# Altium schematic sheet OMODRI_EnDATEnc.SchDoc
size A3; Date: Not shown in title block; ApprovedBy: Not shown in title block; CheckedBy: Not shown in title block; Author: Not shown in title block; CompanyName: Not shown in title block; Engineer: Not shown in title block; Organization: Not shown in title block; Address1: Not shown in title block; Address2: Not shown in title block; Address3: Not shown in title block; Address4: Not shown in title block; DocumentNumber: 1; Revision: Use project parameter SCH_Rev; SheetNumber: 3; SheetTotal: 4; PageSetup: Record=PageOptions|CenterHorizontal=True|CenterVertical=True|PrintScale=1.00|XCorrection=1.00|YCorrection=1.00|PrintKind=0|BorderSize=5000000|LeftOffset=0|BottomOffset=0|Orientation=2|PaperLength=1000|PaperWidth=1000|Scale=100|PaperSource=15|PrintQuality=600|MediaType=1|DitherType=10|PaperKind=Letter|PrintScaleMode=1; CurrentTime: Not shown in title block; CurrentDate: Not shown in title block; Time: Not shown in title block; DocumentFullPathAndName: Not shown in title block; DocumentName: Not shown in title block; ModifiedDate: Not shown in title block; ImagePath: Not shown in title block
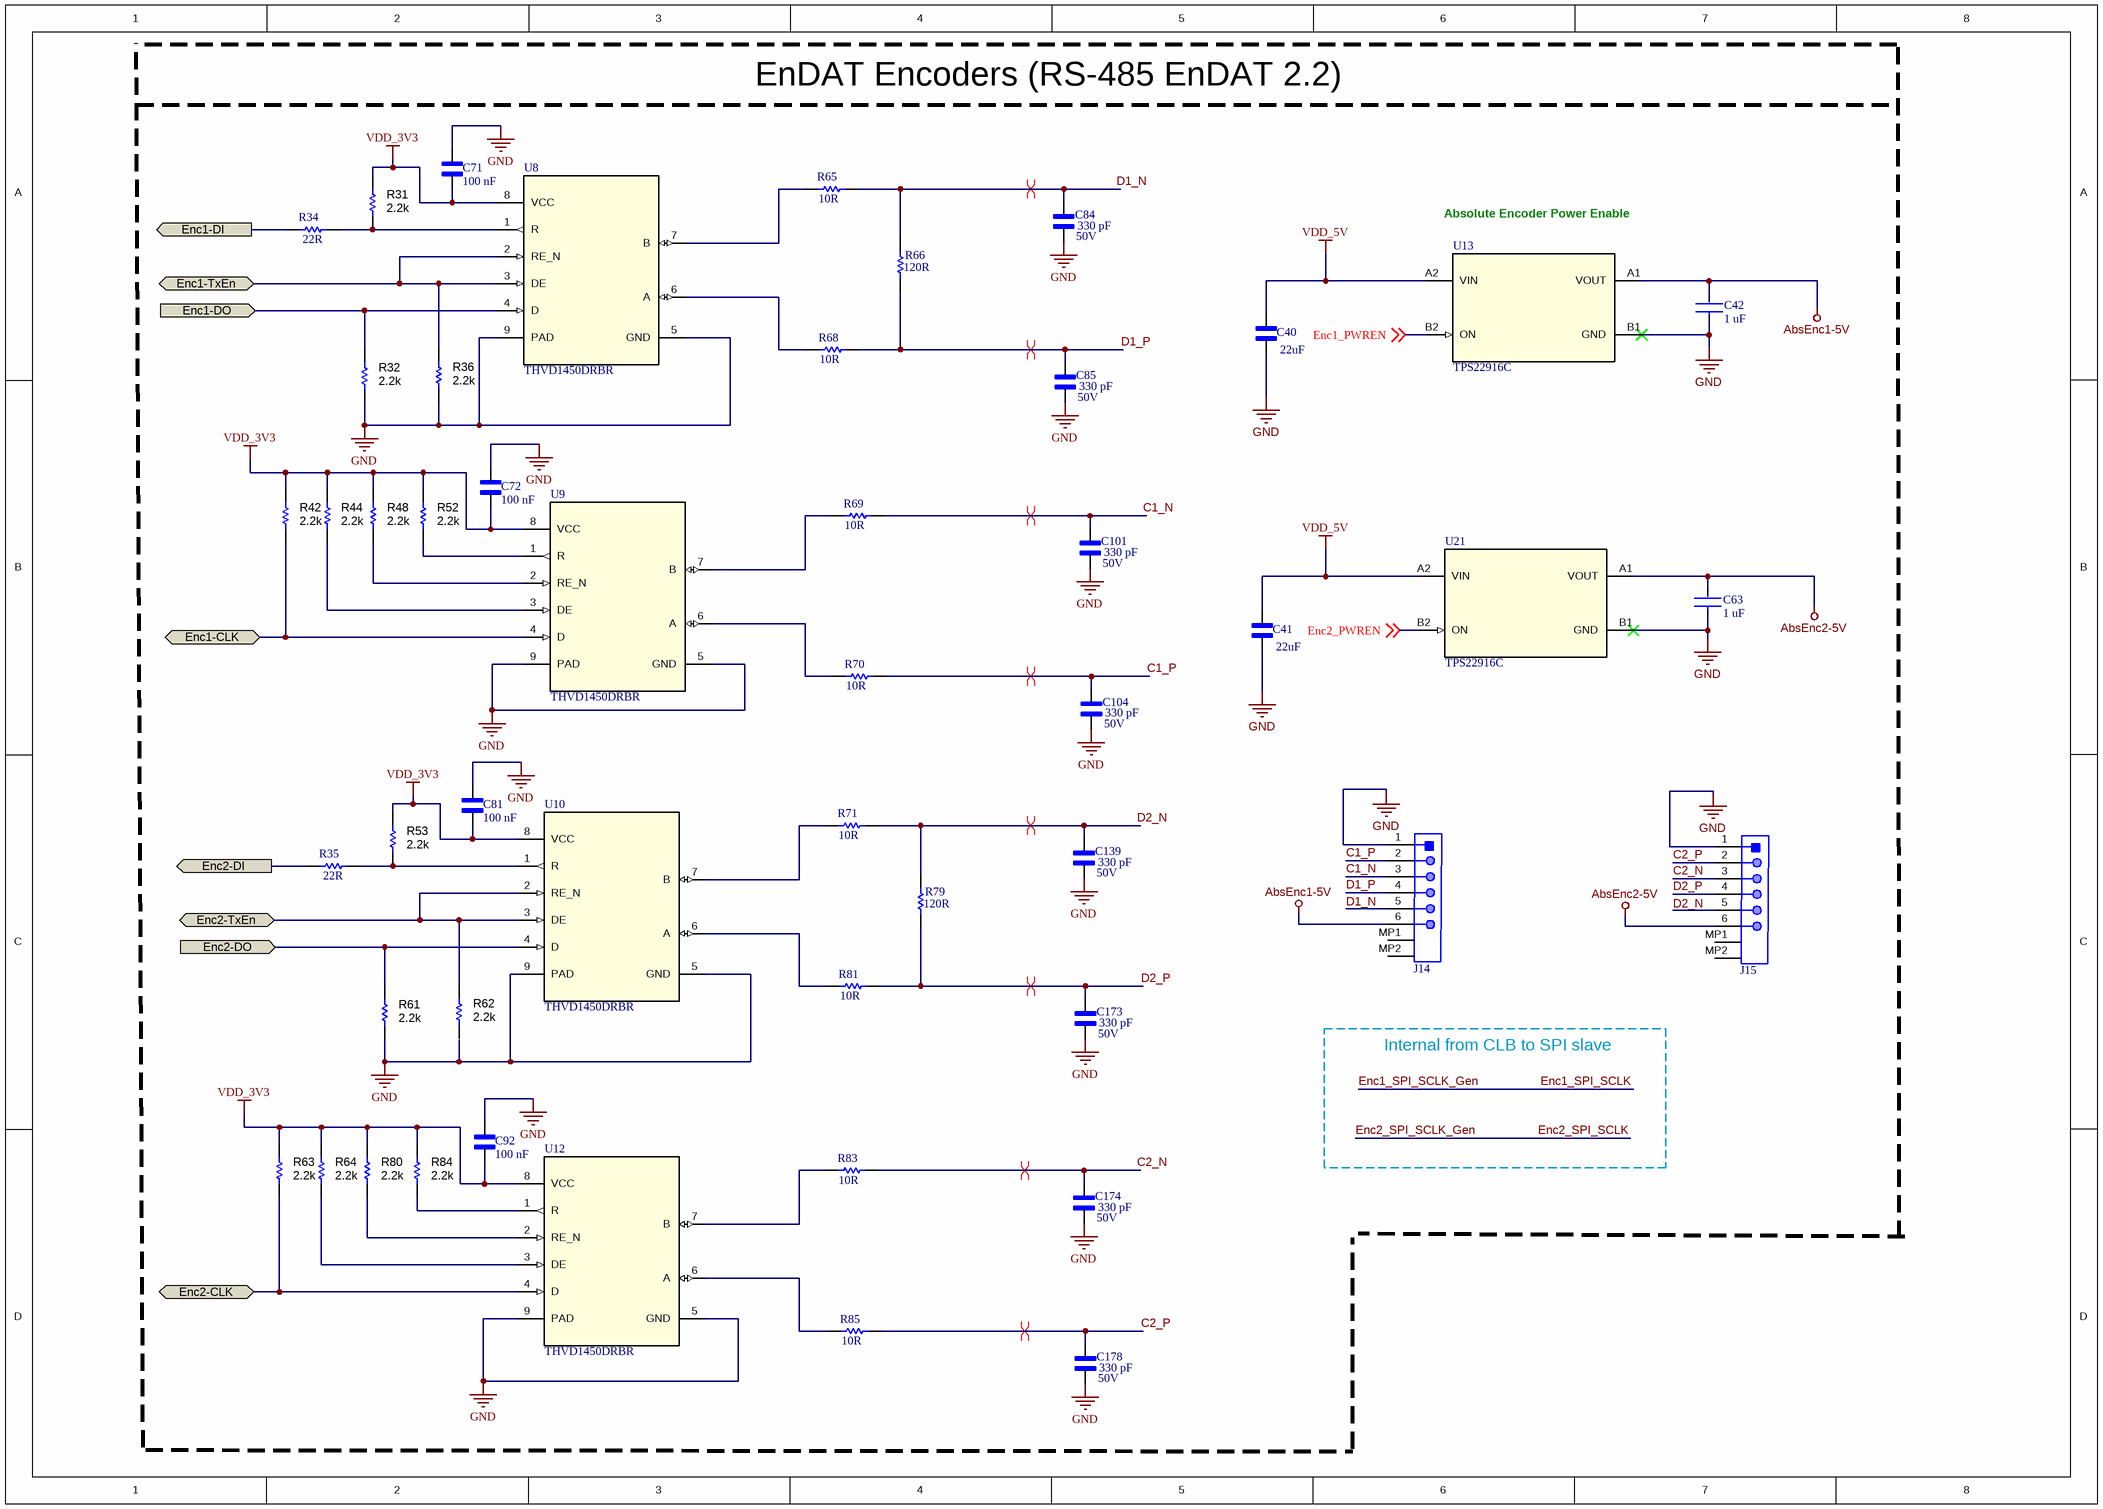
[diagram p0: OMODRI_EnDATEnc.SchDoc]

## Parts
C40  value 22uF  [CAPC1005X55N]  (hidden comment: CL05A226MQ5N6J8)
C41  value 22uF  [CAPC1005X55N]  (hidden comment: CL05A226MQ5N6J8)
C42  value 1 uF  [FP-CC0201-BA-MFG]  (hidden comment: CC0201MRX5R5BB105)
C63  value 1 uF  [FP-CC0201-BA-MFG]  (hidden comment: CC0201MRX5R5BB105)
C71  value 100 nF  [CAPC0603X33N]  (hidden comment: GRM033R61E104KE14D)
C72  value 100 nF  [CAPC0603X33N]  (hidden comment: GRM033R61E104KE14D)
C81  value 100 nF  [CAPC0603X33N]  (hidden comment: GRM033R61E104KE14D)
C84  value 330 pF  Voltage: 50V  [CAPC0603X33N]  (hidden comment: GRM033R71H331KA12D)
C85  value 330 pF  Voltage: 50V  [CAPC0603X33N]  (hidden comment: GRM033R71H331KA12D)
C92  value 100 nF  [CAPC0603X33N]  (hidden comment: GRM033R61E104KE14D)
C101  value 330 pF  Voltage: 50V  [CAPC0603X33N]  (hidden comment: GRM033R71H331KA12D)
C104  value 330 pF  Voltage: 50V  [CAPC0603X33N]  (hidden comment: GRM033R71H331KA12D)
C139  value 330 pF  Voltage: 50V  [CAPC0603X33N]  (hidden comment: GRM033R71H331KA12D)
C173  value 330 pF  Voltage: 50V  [CAPC0603X33N]  (hidden comment: GRM033R71H331KA12D)
C174  value 330 pF  Voltage: 50V  [CAPC0603X33N]  (hidden comment: GRM033R71H331KA12D)
C178  value 330 pF  Voltage: 50V  [CAPC0603X33N]  (hidden comment: GRM033R71H331KA12D)
J14  Conn_JST_BM06B-GHS-TBT_LF_SN_N_eec  [JST_BM06B-GHS-TBT_LF_SN_N_0]  (value not drawn)
J15  Conn_JST_BM06B-GHS-TBT_LF_SN_N_eec  [JST_BM06B-GHS-TBT_LF_SN_N_0]  (value not drawn)
R31  ValueDisplayed: 2.2k  [0402]  (hidden comment: CRCW04022K20JNED)
R32  ValueDisplayed: 2.2k  [0402]  (hidden comment: CRCW04022K20JNED)
R34  value 22R  [RESC1005X40X25ML05T05]  (hidden comment: ERJ-2GEJ220X)
R35  value 22R  [RESC1005X40X25ML05T05]  (hidden comment: ERJ-2GEJ220X)
R36  ValueDisplayed: 2.2k  [0402]  (hidden comment: CRCW04022K20JNED)
R42  ValueDisplayed: 2.2k  [0402]  (hidden comment: CRCW04022K20JNED)
R44  ValueDisplayed: 2.2k  [0402]  (hidden comment: CRCW04022K20JNED)
R48  ValueDisplayed: 2.2k  [0402]  (hidden comment: CRCW04022K20JNED)
R52  ValueDisplayed: 2.2k  [0402]  (hidden comment: CRCW04022K20JNED)
R53  ValueDisplayed: 2.2k  [0402]  (hidden comment: CRCW04022K20JNED)
R61  ValueDisplayed: 2.2k  [0402]  (hidden comment: CRCW04022K20JNED)
R62  ValueDisplayed: 2.2k  [0402]  (hidden comment: CRCW04022K20JNED)
R63  ValueDisplayed: 2.2k  [0402]  (hidden comment: CRCW04022K20JNED)
R64  ValueDisplayed: 2.2k  [0402]  (hidden comment: CRCW04022K20JNED)
R65  Resistance: 10R  [RESC1005X40X25ML05T10]  (hidden comment: CRCW040210R0FKEDHP)
R66  Resistance: 120R  [RESC1005X40X25ML05T10]  (hidden comment: CRCW0402120RJNEDHP)
R68  Resistance: 10R  [RESC1005X40X25ML05T10]  (hidden comment: CRCW040210R0FKEDHP)
R69  Resistance: 10R  [RESC1005X40X25ML05T10]  (hidden comment: CRCW040210R0FKEDHP)
R70  Resistance: 10R  [RESC1005X40X25ML05T10]  (hidden comment: CRCW040210R0FKEDHP)
R71  Resistance: 10R  [RESC1005X40X25ML05T10]  (hidden comment: CRCW040210R0FKEDHP)
R79  Resistance: 120R  [RESC1005X40X25ML05T10]  (hidden comment: CRCW0402120RJNEDHP)
R80  ValueDisplayed: 2.2k  [0402]  (hidden comment: CRCW04022K20JNED)
R81  Resistance: 10R  [RESC1005X40X25ML05T10]  (hidden comment: CRCW040210R0FKEDHP)
R83  Resistance: 10R  [RESC1005X40X25ML05T10]  (hidden comment: CRCW040210R0FKEDHP)
R84  ValueDisplayed: 2.2k  [0402]  (hidden comment: CRCW04022K20JNED)
R85  Resistance: 10R  [RESC1005X40X25ML05T10]  (hidden comment: CRCW040210R0FKEDHP)
U8  THVD1450DRBR  [DRB0008F]
U9  THVD1450DRBR  [DRB0008F]
U10  THVD1450DRBR  [DRB0008F]
U12  THVD1450DRBR  [DRB0008F]
U13  TPS22916C  [YFP0004ABAB]
U21  TPS22916C  [YFP0004ABAB]

## Ports
Enc1-CLK (bidir), Enc1-DI (out), Enc1-DO (in), Enc1-TxEn (bidir), Enc2-CLK (bidir), Enc2-DI (out), Enc2-DO (in), Enc2-TxEn (bidir)

## Nets
AbsEnc1-5V: C42.2 J14.6 U13.A1(VOUT)
AbsEnc2-5V: C63.2 J15.6 U21.A1(VOUT)
GND: C40.1 C41.1 C42.1 C63.1 C71.2 C72.2 C81.2 C84.1 C85.1 C92.2 C101.1 C104.1 C139.1 C173.1 C174.1 C178.1 J14.1 J15.1 R32.1 R61.1 U8.5(GND) U8.9(PAD) U9.5(GND) U9.9(PAD) U10.5(GND) U10.9(PAD) U12.5(GND) U12.9(PAD) U13.B1(GND) U21.B1(GND)
VDD_3V3: C71.1 C72.1 C81.1 C92.1 R31.2 R42.2 R44.2 R48.2 R52.2 R53.2 R63.2 R64.2 R80.2 R84.2 U8.8(VCC) U9.8(VCC) U10.8(VCC) U12.8(VCC)
VDD_5V: C40.2 C41.2 U13.A2(VIN) U21.A2(VIN)
C1_N: C101.2 J14.3 R69.2
C1_P: C104.2 J14.2 R70.2
C2_N: C174.2 J15.3 R83.2
C2_P: C178.2 J15.2 R85.2
D1_N: C84.2 R65.2 R66.2
D1_P: C85.2 J14.4 R66.1 R68.2
D2_N: C139.2 R71.2 R79.2
D2_P: C173.2 J15.4 R79.1 R81.2
Enc1-CLK: R42.1 U9.4(D) ; port Enc1-CLK
Enc1-DI: R34.1 ; port Enc1-DI
Enc1-DO: R32.2 U8.4(D) ; port Enc1-DO
Enc1-TxEn: R36.2 U8.2(RE_N) U8.3(DE) ; port Enc1-TxEn
Enc1_PWREN: U13.B2(ON) ; off-sheet Enc1_PWREN
Enc2-CLK: R63.1 U12.4(D) ; port Enc2-CLK
Enc2-DI: R35.1 ; port Enc2-DI
Enc2-DO: R61.2 U10.4(D) ; port Enc2-DO
Enc2-TxEn: R62.2 U10.2(RE_N) U10.3(DE) ; port Enc2-TxEn
Enc2_PWREN: U21.B2(ON) ; off-sheet Enc2_PWREN
NetR31_1: R31.1 R34.2 U8.1(R)
NetR35_2: R35.2 R53.1 U10.1(R)
NetR44_1: R44.1 U9.3(DE)
NetR48_1: R48.1 U9.2(RE_N)
NetR52_1: R52.1 U9.1(R)
NetR64_1: R64.1 U12.3(DE)
NetR65_1: R65.1 U8.7(B)
NetR68_1: R68.1 U8.6(A)
NetR69_1: R69.1 U9.7(B)
NetR70_1: R70.1 U9.6(A)
NetR71_1: R71.1 U10.7(B)
NetR80_1: R80.1 U12.2(RE_N)
NetR81_1: R81.1 U10.6(A)
NetR83_1: R83.1 U12.7(B)
NetR84_1: R84.1 U12.1(R)
NetR85_1: R85.1 U12.6(A)

Not connected (* = marked no-connect by the designer): J14 5 MP1 MP2; J15 5 MP1 MP2; R36 1; R62 1

## Layout directives
differential pair: C1_N, C1_P, C2_N, C2_P, D1_N, D1_P, D2_N, D2_P

## Notes on the sheet
- EnDAT Encoders (RS-485 EnDAT 2.2)
- Absolute Encoder Power Enable
- Internal from CLB to SPI slave
- Labels drawn without touching a wire or pin: D1_N, D2_N
- Drawn By:
- SVN Rev:
- Number:
- TID #:
- Orderable:
- Rev:
- Sheet Title:
- File:
- Project Title:
- Designed for:
- Assembly Variant:
- Mod. Date:
- Sheet:
- Size:
- of
- B
- http://www.ti.com
- Texas Instruments and/or its licensors do not warrant the accuracy or completeness of this specification or any information contained therein. Texas Instruments and/or its licensors do not warrant that this design will meet the specifications, will be suitable for your application or fit for any particular purpose, or will operate in an implementation. Texas Instruments and/or its licensors do not warrant that the design is production worthy. You should completely validate and test your design implementation to confirm the system functionality for your application.
- Engineer:
- Contact:
- © Texas Instruments

## Library data of the parts
C40 C41 = CL05A226MQ5N6J8: 22µF ±20% 6.3V Ceramic Capacitor X5R 0402 (1005 Metric); MF: Samsung Electro-Mechanics; Package: 0402 Samsung Electro-Mechanics; Availability: Unavailable; MP: CL05A226MQ5N6J8; DigiKey-Purchase-URL: https://snapeda.com/shop?store=DigiKey&id=3601912; SnapEDA_Link: https://www.snapeda.com/parts/CL05A226MQ5N6J8/Samsung%20Electro-Mechanics/view-part/3601912/?ref=snap; Price: None
C42 C63 = CMP-03422-000660-1: CAP CER 1UF 6.3V X5R 0201; Manufacturer: Yageo; Material: Ceramic; Tolerance: 0.2; Temperature Coefficient: 15%; Lead Free: Yes; Capacitance: 1 uF; ComponentLink2URL: http://www.yageo.com/documents/recent/UPY-GPHC_X5R_4V-to-50V_25.pdf; Footprint Url: http://www.yageo.com/exep/pages/download/literatures/UPY-C_GEN_24.pdf; Temperature Range Low: -55°C; Category: Cap; Device Class L3: Ceramic Capacitors; Device Class L2: Capacitors; Digikey Description: CAP CER 1UF 6.3V X5R 0201; Automotive: No; Temperature: -55°C to +85°C; RoHS: TRUE; Octopart: https://octopart.com/cc0201mrx5r5bb105-yageo-33242268; Height: 0.33mm; Temperature Range High: +85°C; Temperature Characteristic: X5R; Device Class L1: Passive Components; Package: CC0201-BA; ComponentLink2Description: Datasheet; Manufacturer Part Number: CC0201MRX5R5BB105; Voltage Rating: 6.3 V; Mouser Description: Multilayer Ceramic Capacitors MLCC - SMD/SMT 1.0uF 6.3V X5R 20%; Ipc Land Pattern Name: CAPC6030X30
C71 C72 C81 C92 = GRM033R61E104KE14D: SMD Capacitor X5R_EIA_ with Capacitance: 0.10uF Tol. 10%. Rated Voltage: 25Vdc; MF: Murata; SnapEDA_Link: https://www.snapeda.com/parts/GRM033R61E104KE14D/Murata/view-part/4375622/?ref=snap; Availability: Unavailable; MP: GRM033R61E104KE14D; Package: 0603 Taiyo Yuden; Price: None
C84 C85 C101 C104 C139 C173 C174 C178 = GRM033R71H331KA12D: SMD Capacitor X7R_EIA_ with Capacitance: 330pF Tol. 10%. Rated Voltage: 50Vdc; MF: Murata; MP: GRM033R71H331KA12D; SnapEDA_Link: https://www.snapeda.com/parts/GRM033R71H331KA12D/Murata/view-part/1976079/?ref=snap; Digi-Key_Purchase_URL: https://www.digikey.com/product-detail/en/murata-electronics/GRM033R71H331KA12D/490-17085-1-ND/7602084?utm_source=snapeda&utm_medium=aggregator&utm_campaign=symbol; Digi-Key_Part_Number: 490-17085-1-ND; Package: 0603 Taiyo Yuden
J14 J15 = Conn_JST_BM06B-GHS-TBT_LF_SN_N_eec: CONN HEADER GH TOP 6POS 1.25MM; Manufacturer: JST; Part Number: BM06B-GHS-TBT(LF)(SN)(N); helpURL: https://upverter.com/upn/revision/9caaf2120726c690/; ComponentLink2Description: Datasheet; Temperature: -25°C to +85°C; Package: HDR06; Supplier 2: Mouser; Price: 0.396190066284; Supplier 1: Digi-Key; ComponentLink1URL: https://upverter.com/upn/revision/9caaf2120726c690/; Supplier Part Number 1: 455-1582-1-ND; ComponentLink1Description: Upverter; ComponentLink2URL: http://www.jst-mfg.com/product/pdf/eng/eGH.pdf; RoHS: TRUE; Temperature Range High: +85°C; Digikey Description: CONN HEADER GH TOP 6POS 1.25MM; Digikey Part Number: 455-1582-1-ND; Temperature Range Low: -25°C; Lead Free: yes
R31 R32 R36 R42 R44 R48 R52 R53 R61-R64 R80 R84 = CMP-0026890-5: RES, 2.2 k, 5%, 0.063 W, AEC-Q200 Grade 0, 0402; Manufacturer: Vishay-Dale; Power_W: 63mW; TempCo: 200 ppm/C; Value_Code: 2k20; Value: 2.2k; EIA_Code: E24; SizeX_mm: 1; SizeY_mm: 0.5; SizeZ_mm: 0.6; Value2: 0.063W; AEC Qualified: Y; VDC_V: 50V; AEC Category: Q200; AEC Grade: 0; Supplier Part Number 2: 59M6710; Supplier 2: Newark; Supplier Part Number 3: 71-CRCW0402J-2.2K-E3; Supplier 3: Mouser; RoHS: E; Value1: 5%; MountType: SMT; Supplier 1: Digi-Key; PackageReference: 0402; Tolerance_%: 5%; Res_ohm: 2.2k; SizeArea_mm2: 0.5; CompType: Resistor; PartNumber: CRCW04022K20JNED; ComponentLink1Description: Datasheet link; Supplier Part Number 1: 541-2.2KJCT-ND; Technology: Thick Film; ComponentLink1URL: http://www.vishay.com/docs/20035/dcrcwe3.pdf
R34 R35 = CMP-2002-00486-1: Manufacturer: Panasonic; Part Number: ERJ-2GEJ220X
R65 R68-R71 R81 R83 R85 = CRCW040210R0FKEDHP: SMD Chip Resistor, 0402 [1005 Metric], 10 ohm, CRCW-HP e3 Series, 50 V, Thick Film, 200 mW; Manufacturer: Vishay Dale; Voltage Rating (DC): 50V; Temperature Coefficient: 100ppm/°C; Tolerance: 1%; Power Rating: 125mW; Part Number: CRCW040210R0FKEDHP; Supplier 1: Digi-Key; Manufacturer Part Number: CRCW040210R0FKEDHP; RoHS: Yes; Category: Chip SMD Resistors; Stock 1: 25822; Pricing 1: 1=0,14000, 10=0,12600, 100=0,04840, 1000=0,02130, 2500=0,01839, 5000=0,01646 (USD); Mount: Surface Mount; Case/Package: 0402; Weight: 2.3E-05oz; Contact Plating: Tin; Case Code (Imperial): 0402; Case Code (Metric): 1005; Min Operating Temperature: -55°C; Max Operating Temperature: 155°C; Packaging: Tape and Reel; Voltage Rating: 50V; Package Quantity: 10000; Termination: SMD/SMT; Composition: Thick Film; Military Standard: Not; Length: 1mm; Height: 0.3mm; Width: 0.5mm; Depth: 0.5mm; Radiation Hardening: No; Lead Free: Lead Free; REACH SVHC: Unknown; ComponentLink1URL: https://datasheet.ciiva.com/5542/crcwhpe3-46056-5542142.pdf?src-supplier=Mouser; ComponentLink1Description: https://datasheet.ciiva.com/5542/crcwhpe3-46056-5542142.pdf?src-supplier=Mouser; Supplier Part Number 1: 541-10.0YCT-ND
R66 R79 = CRCW0402120RJNEDHP: RES SMD 120 OHM 5% 1/5W 0402; Manufacturer: Vishay Dale; Power Rating: 125mW; Voltage Rating: 50V; Temperature Coefficient: 200ppm/°C; Part Number: CRCW0402120RJNEDHP; Supplier 1: Digi-Key; Manufacturer Part Number: CRCW0402120RJNEDHP; RoHS: Yes; Category: Chip SMD Resistors; Stock 1: 18750; Pricing 1: 1=0,13000, 10=0,11300, 100=0,04350, 1000=0,01912, 2500=0,01651, 5000=0,01477 (USD); Case/Package: 0402; Weight: 2.3E-05oz; Case Code (Metric): 1005; Case Code (Imperial): 0402; Min Operating Temperature: -55°C; Max Operating Temperature: 155°C; Package Quantity: 1; Tolerance: 5%; Packaging: Tape and Reel; Composition: Thick Film; Max Power Dissipation: 125mW; Features: Automotive AEC-Q200; Number of Terminations: 2; Termination: SMD/SMT; Military Standard: Not; Length: 1mm; Height: 0.016inch; Width: 0.02inch; Depth: 0.5mm; Lead Free: Lead Free; ComponentLink1URL: https://datasheet.ciiva.com/12577/crcwhpe3-46056-12577101.pdf?src-supplier=Mouser; ComponentLink1Description: https://datasheet.ciiva.com/12577/crcwhpe3-46056-12577101.pdf?src-supplier=Mouser; ComponentLink2URL: https://datasheet.ciiva.com/6548/crcwhpe3-6548111.pdf?src-supplier=Digi-Key; ComponentLink2Description: https://datasheet.ciiva.com/6548/crcwhpe3-6548111.pdf?src-supplier=Digi-Key; Supplier Part Number 1: 541-120YACT-ND
U8-U10 U12 = THVD1450DRBR: Manufacturer: Texas Instruments; Simplex/Duplex: Half Duplex; PartNumber: THVD1450DRBR; RefDes: RefDes; TYPE: TYPE; Value: Value; Supplier 1: Mouser; Manufacturer Part Number: THVD1450DRBR; RoHS: No; Stock 1: 8004; Pricing 1: 1=2,56000, 10=2,18000, 100=1,74000, 500=1,52000, 1000=1,26000, 3000=1,17000, 6000=1,13000, 9000=1,08000 (USD); Min Operating Temperature: -40°C; Max Operating Temperature: 125°C; Supplier Part Number 1: 595-THVD1450DRBR
U13 U21 = TPS22916C: TPS22916CY Single-Channel Ultra-Low Leakage Load Switch 2A 60 mO 1V to 5.5V 4-Pin DSBGA T/R; Manufacturer: Texas Instruments; Manufacturer Part Number: TPS22916CYFPR; Number of Channels: 1; Fault Protection: Reverse Current; Output Configuration: High Side; Supplier 1: Digi-Key; RoHS: No; Stock 1: 2282; Pricing 1: 1=0,42000, 10=0,36400, 25=0,33960, 100=0,25220, 250=0,21340, 500=0,20370, 1000=0,15035 (USD); Min Operating Temperature: -40°C; Max Operating Temperature: 85°C; Packaging: Tape and Reel; Number of Outputs: 1; Max Output Current: 2A; ComponentLink1URL: http://www.ti.com/lit/ds/symlink/tps22916.pdf?src-supplier=Digi-Key; ComponentLink1Description: http://www.ti.com/lit/ds/symlink/tps22916.pdf?src-supplier=Digi-Key; Supplier Part Number 1: 296-50065-1-ND